# Altium schematic sheet Connectors & LEDs.SchDoc
size A4
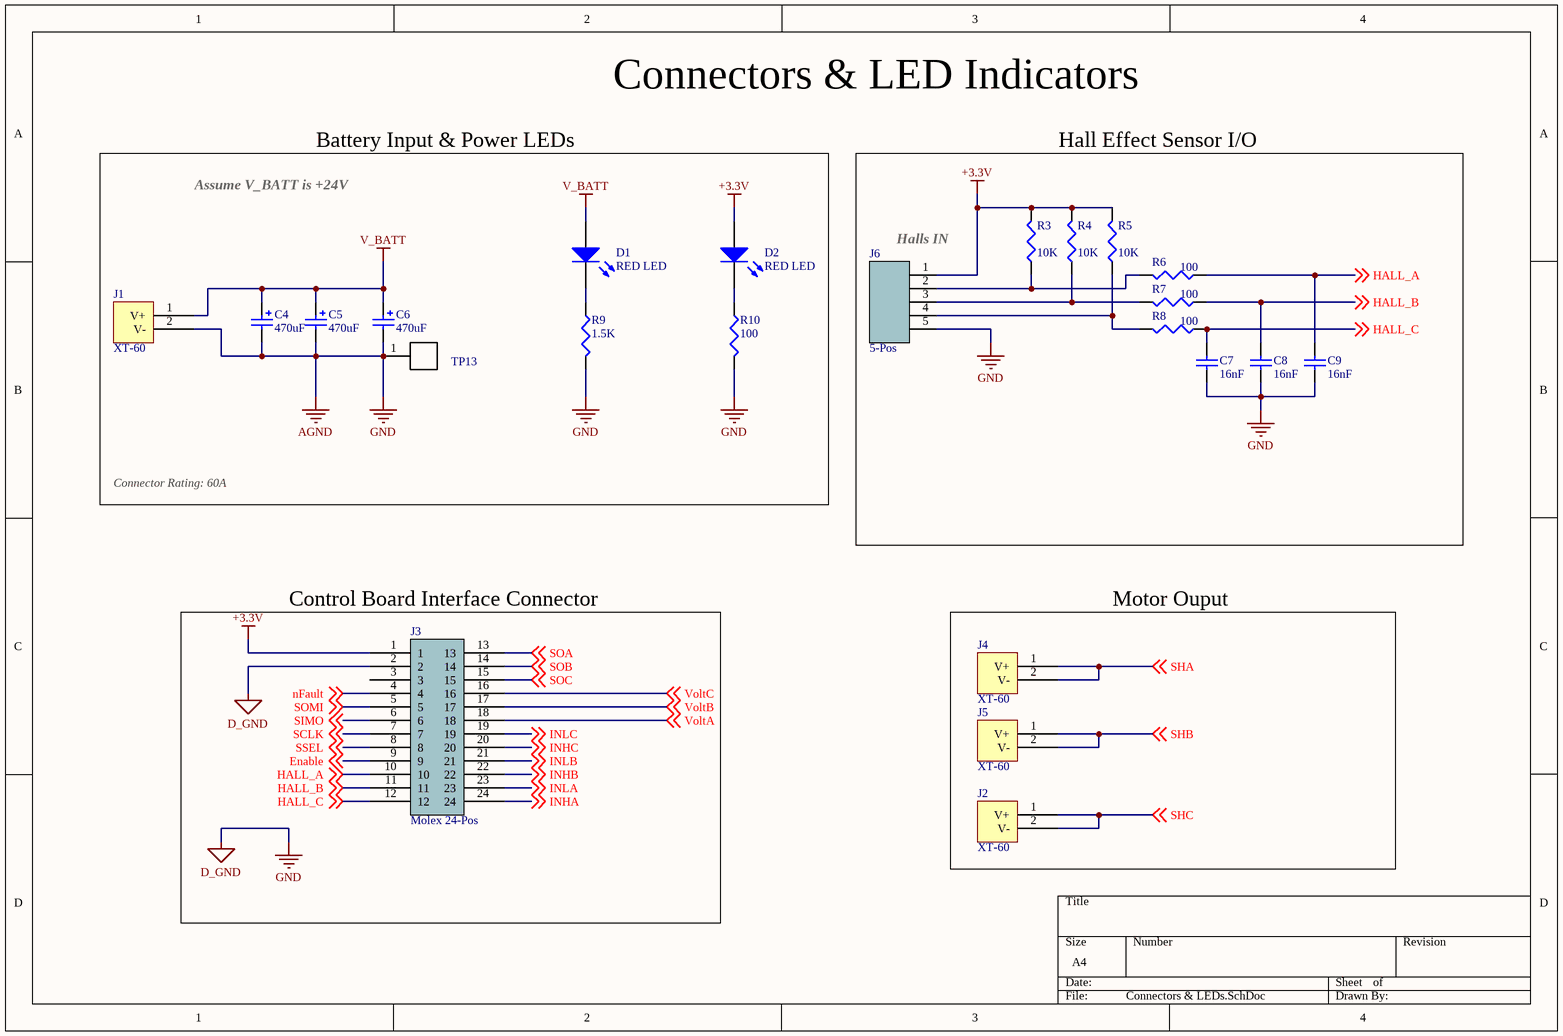
[diagram p0: Connectors & LEDs.SchDoc]

## Parts
C4  470uF  [ECA1JHG471]
C5  470uF  [ECA1JHG471]
C6  470uF  [ECA1JHG471]
C7  16nF  [0603 CAP Medium]
C8  16nF  [0603 CAP Medium]
C9  16nF  [0603 CAP Medium]
D1  RED LED  [CAPC1608X05L - Polarized]
D2  RED LED  [CAPC1608X05L - Polarized]
J1  XT-60  [XTC60PW-M]
J2  XT-60  [XTC60PW-M]
J3  Molex 24-Pos  [PCBComponent_1]
J4  XT-60  [XTC60PW-M]
J5  XT-60  [XTC60PW-M]
J6  5-Pos  [Hirose 5-pos]
R3  value 10K  [RES 0603 MEDIUM]  (hidden comment: Res3)
R4  value 10K  [RES 0603 MEDIUM]  (hidden comment: Res3)
R5  value 10K  [RES 0603 MEDIUM]  (hidden comment: Res3)
R6  value 100  [RES 0603 MEDIUM]  (hidden comment: Res3)
R7  value 100  [RES 0603 MEDIUM]  (hidden comment: Res3)
R8  value 100  [RES 0603 MEDIUM]  (hidden comment: Res3)
R9  value 1.5K  [0805 Res]  (hidden comment: Res3)
R10  value 100  [RES 0603 MEDIUM]  (hidden comment: Res3)
TP13  1625854-3  [TE_RCU-0C]  (value not drawn)

## Blocks framed on the sheet
Battery Input & Power LEDs: C4-C6 D1 D2 J1 R9 R10 TP13
Hall Effect Sensor I/O: C7-C9 J6 R3-R8
Control Board Interface Connector: J3
Motor Ouput: J2 J4 J5

## Nets
+3.3V: D2.1(A) J3.1 J6.1 R3.2 R4.2 R5.2
AGND: C4.2 C5.2 C6.2 C7.1 C8.1 C9.1 J1.2(V-) J3.2 J6.5 R9.2 R10.2 TP13.1  [also labelled D_GND, GND]
V_BATT: C4.1 C5.1 C6.1 D1.1(A) J1.1(V+)
Enable: J3.9 ; off-sheet Enable
HALL_A: C9.2 J3.10 R6.1 ; off-sheet HALL_A
HALL_B: C8.2 J3.11 R7.1 ; off-sheet HALL_B
HALL_C: C7.2 J3.12 R8.1 ; off-sheet HALL_C
INHA: J3.24 ; off-sheet INHA
INHB: J3.22 ; off-sheet INHB
INHC: J3.20 ; off-sheet INHC
INLA: J3.23 ; off-sheet INLA
INLB: J3.21 ; off-sheet INLB
INLC: J3.19 ; off-sheet INLC
nFault: J3.4 ; off-sheet nFault
SCLK: J3.7 ; off-sheet SCLK
SHA: J4.1(V+) J4.2(V-) ; off-sheet SHA
SHB: J5.1(V+) J5.2(V-) ; off-sheet SHB
SHC: J2.1(V+) J2.2(V-) ; off-sheet SHC
SIMO: J3.6 ; off-sheet SIMO
SOA: J3.13 ; off-sheet SOA
SOB: J3.14 ; off-sheet SOB
SOC: J3.15 ; off-sheet SOC
SOMI: J3.5 ; off-sheet SOMI
SSEL: J3.8 ; off-sheet SSEL
VoltA: J3.18 ; off-sheet VoltA
VoltB: J3.17 ; off-sheet VoltB
VoltC: J3.16 ; off-sheet VoltC
NetD1_2: D1.2(K) R9.1
NetD2_2: D2.2(K) R10.1
NetJ6_2: J6.2 R3.1 R6.2
NetJ6_3: J6.3 R4.1 R7.2
NetJ6_4: J6.4 R5.1 R8.2

Not connected (* = marked no-connect by the designer): J3 3

## Notes on the sheet
- Connectors & LED Indicators
- Assume V_BATT is +24V
- (near J6) Halls IN
- Connector Rating: 60A

## Library data of the parts
C4-C6 = ECA-1JHG471: Cap Aluminum Lytic 470uF 63V 20% (12.5 X 20mm) Radial 5mm 640mA 2000h 105C Bulk; Manufacturer: Panasonic; Life (Hours): 2000Hour; Lead/Base Style: Straight; Polarity: Polar; Leakage Current: 3uA; Dissipation Factor: 0.1%; Lead Diameter: 0.6mm; Supplier 1: Digi-Key; Manufacturer Part Number: ECA-1JHG471; Stock 1: 12555; Pricing 1: 1=0.88, 10=0.67, 100=0.4792, 500=0.371, 1000=0.31948, 2500=0.29887, 5000=0.28341 (USD); Mount: Through Hole,PCB; Case/Package: Radial; Contact Plating: Tin; Min Operating Temperature: -55°C; Max Operating Temperature: 105°C; Capacitance: 470uF; Tolerance: 20%; Ripple Current: 640mA; Termination: Radial; Voltage Rating (DC): 63V; Packaging: Bulk; Package Quantity: 200; Voltage Rating: 63V; Voltage: 63V; Diameter: 12.5mm; Length: 20mm; Height: 20mm; Lead Pitch: 5mm; Height - Seated (Max): 0.866inch; Radiation Hardening: No; REACH SVHC: No SVHC; ComponentLink1URL: https://datasheet.ciiva.com/14590/70067776-14590006.pdf; ComponentLink1Description: https://datasheet.ciiva.com/14590/70067776-14590006.pdf; ComponentLink2URL: https://datasheet.ciiva.com/17356/aba0000ce26-17356313.pdf; ComponentLink2Description: https://datasheet.ciiva.com/17356/aba0000ce26-17356313.pdf; ComponentLink3URL: https://datasheet.ciiva.com/48521/radial-nhg-eng-tds-48521993.pdf; ComponentLink3Description: https://datasheet.ciiva.com/48521/radial-nhg-eng-tds-48521993.pdf; ComponentLink4URL: https://datasheet.ciiva.com/30116/8aba0000ce26-30116426.pdf; ComponentLink4Description: https://datasheet.ciiva.com/30116/8aba0000ce26-30116426.pdf; ComponentLink5URL: https://datasheet.ciiva.com/2984/aba0000ce26-2984364.pdf; ComponentLink5Description: https://datasheet.ciiva.com/2984/aba0000ce26-2984364.pdf; ComponentLink6URL: https://datasheet.ciiva.com/11783/0900766b800301b8-11783820.pdf; ComponentLink6Description: https://datasheet.ciiva.com/11783/0900766b800301b8-11783820.pdf; ComponentLink7URL: https://datasheet.ciiva.com/43485/1504317-43485276.pdf; ComponentLink7Description: https://datasheet.ciiva.com/43485/1504317-43485276.pdf
C7-C9 = 06035C163KAT2A: Multilayer Ceramic Capacitors MLCC - SMD/SMT 50volts 0.016uF 10% X7R; Manufacturer: Kyocera AVX; Voltage Rating: 50V; Dissipation Factor: 2.5%; Supplier 1: Digi-Key; Manufacturer Part Number: 06035C163KAT2A; Stock 1: 10610; Pricing 1: 1=0.33, 10=0.224, 100=0.1271, 500=0.0897, 1000=0.07849 (USD); Mount: Surface Mount; Case/Package: 0603; Number of Pins: 2; Case Code (Metric): 1608; Case Code (Imperial): 0603; Min Operating Temperature: -55°C; Max Operating Temperature: 125°C; Package Quantity: 4000; Capacitance: 16nF; Tolerance: 10%; Packaging: Tape and Reel; Voltage Rating (DC): 50V; Dielectric: X7R; Termination: SMD/SMT; Length: 1.6mm; Width: 0.032inch; Thickness: 0.035inch; Depth: 0.81mm; Radiation Hardening: No; ComponentLink1URL: https://datasheet.ciiva.com/205/cx7r-205833.pdf; ComponentLink1Description: https://datasheet.ciiva.com/205/cx7r-205833.pdf; ComponentLink2URL: https://datasheet.ciiva.com/5418/cx7r-218113-5418475.pdf; ComponentLink2Description: https://datasheet.ciiva.com/5418/cx7r-218113-5418475.pdf; Supplier 2: Digi-Key
D1 D2 = LTST-C191KRKT: LED RED CLEAR 0603 SMD; Manufacturer: Vishay Lite-On; Lens Colour: Colorless; Power Rating: 75mW; Luminous Intensity: 54mcd; Viewing Angle: 130°; Forward Voltage: 2V; Lens Style: Clear,Colorless,Diffused,Rectangular; Forward Current: 30mA; Dominant Wavelength: 631nm; Test Current: 20mA; Number of Elements: 1; Wavelength: 639nm; Reverse Voltage: 5V; Current: 2A; Supplier 1: Future Electronics; Manufacturer Part Number: LTST-C191KRKT; Stock 1: 1170; Pricing 1: 1=0.059, 250=0.048, 750=0.046, 1500=0.045, 2500=0.043 (USD); Mount: Surface Mount; Case/Package: 0603; Number of Pins: 2; Colour: Red; Case Code (Metric): 1608; Case Code (Imperial): 0603; Min Operating Temperature: -55°C; Max Operating Temperature: 85°C; Packaging: Tape and Reel; Package Quantity: 1; Illumination Colour: Red; Lens Transparency: Clear; Power Dissipation: 75mW; Number of LEDs: 1; Voltage: 2V; Length: 1.6mm; Height: 0.55mm; Width: 0.8mm; Depth: 0.8mm; Radiation Hardening: No; Lead Free: Lead Free; ComponentLink1URL: http://optoelectronics.liteon.com/upload/download/DS22-2000-223/LTST-C191KRKT.PDF; ComponentLink1Description: http://optoelectronics.liteon.com/upload/download/DS22-2000-223/LTST-C191KRKT.PDF; ComponentLink2URL: http://www1.futureelectronics.com/doc/LITE-ON/LTST-C191KRKT.pdf; ComponentLink2Description: http://www1.futureelectronics.com/doc/LITE-ON/LTST-C191KRKT.pdf; ComponentLink3URL: https://www.verical.com/server-webapp/html/getDatasheet?partID=141922; ComponentLink3Description: https://www.verical.com/server-webapp/html/getDatasheet?partID=141922; ComponentLink4URL: http://www.mouser.com/ds/2/239/LTST-C191KRKT-1140668.pdf; ComponentLink4Description: http://www.mouser.com/ds/2/239/LTST-C191KRKT-1140668.pdf
J1 J2 J4 J5 = XT-60: XT-60 Power Connector; Current_Max: 60; ComponentLink1Description: Mechanical; ComponentLink1URL: https://cdn.sparkfun.com/datasheets/Prototyping/xt60.pdf
J3 = Molex 24-Pos (0039301240)
J6 = 5 pos: ComponentLink1Description: 5-pos Hirose; ComponentLink1URL: https://www.digikey.ca/product-detail/en/hirose-electric-co-ltd/DF3A-5P-2DSA/H2097-ND/141521
R3-R10 = Res3: Resistor; Published: 8-Jun-2000; LatestRevisionDate: 29-May-2009; LatestRevisionNote: IPC-7351 Footprint Added.; PackageReference: J1-0603; Publisher: Altium Limited; PackageDescription: Chip Resistor
  R3-R5: ComponentLink1Description: 10KOhm; ComponentLink1URL: https://www.digikey.ca/product-detail/en/vishay-dale/CRCW060310K0FKEAHP/541-10.0KSCT-ND/2222780
  R6-R8 R10: ComponentLink1Description: 100Ohm; ComponentLink1URL: https://www.digikey.ca/product-detail/en/vishay-dale/CRCW0603100RFKEA/541-100HCT-ND/1179695
  R9: ComponentLink1Description: 1.5KOhm; ComponentLink1URL: https://www.digikey.ca/product-detail/en/rohm-semiconductor/ESR10EZPJ152/RHM1.5KKCT-ND/1762968
TP13 = RCU-0C: 0603 PROBE PAD; Resistance: <.05; Power_Rating: 0 W; MF: TE Connectivity; Tolerance: 0%; Package: 0603; Digi-Key_Part_Number: A106145CT-ND; Digi-Key_Purchase_URL: https://www.digikey.ca/product-detail/en/te-connectivity-amp-connectors/RCU-0C/A106145CT-ND/3477802?utm_source=snapeda&utm_medium=aggregator&utm_campaign=symbol; MP: RCU-0C; SnapEDA_Link: https://www.snapeda.com/parts/RCU-0C/TE%20Connectivity%20AMP%20Connectors/view-part/?ref=snap; EU_RoHS_Compliance: Compliant; TE_purchase_URL: https://www.te.com/usa-en/product-1625854-3.html?te_bu=Cor&te_type=disp&te_campaign=seda_glo_cor-seda-global-disp-prtnr-fy19-seda-model-bom-cta_sma-317_1&elqCampaignId=32493; Value: *